# EAGLE schematic buggym (EAGLE 7.3.0)
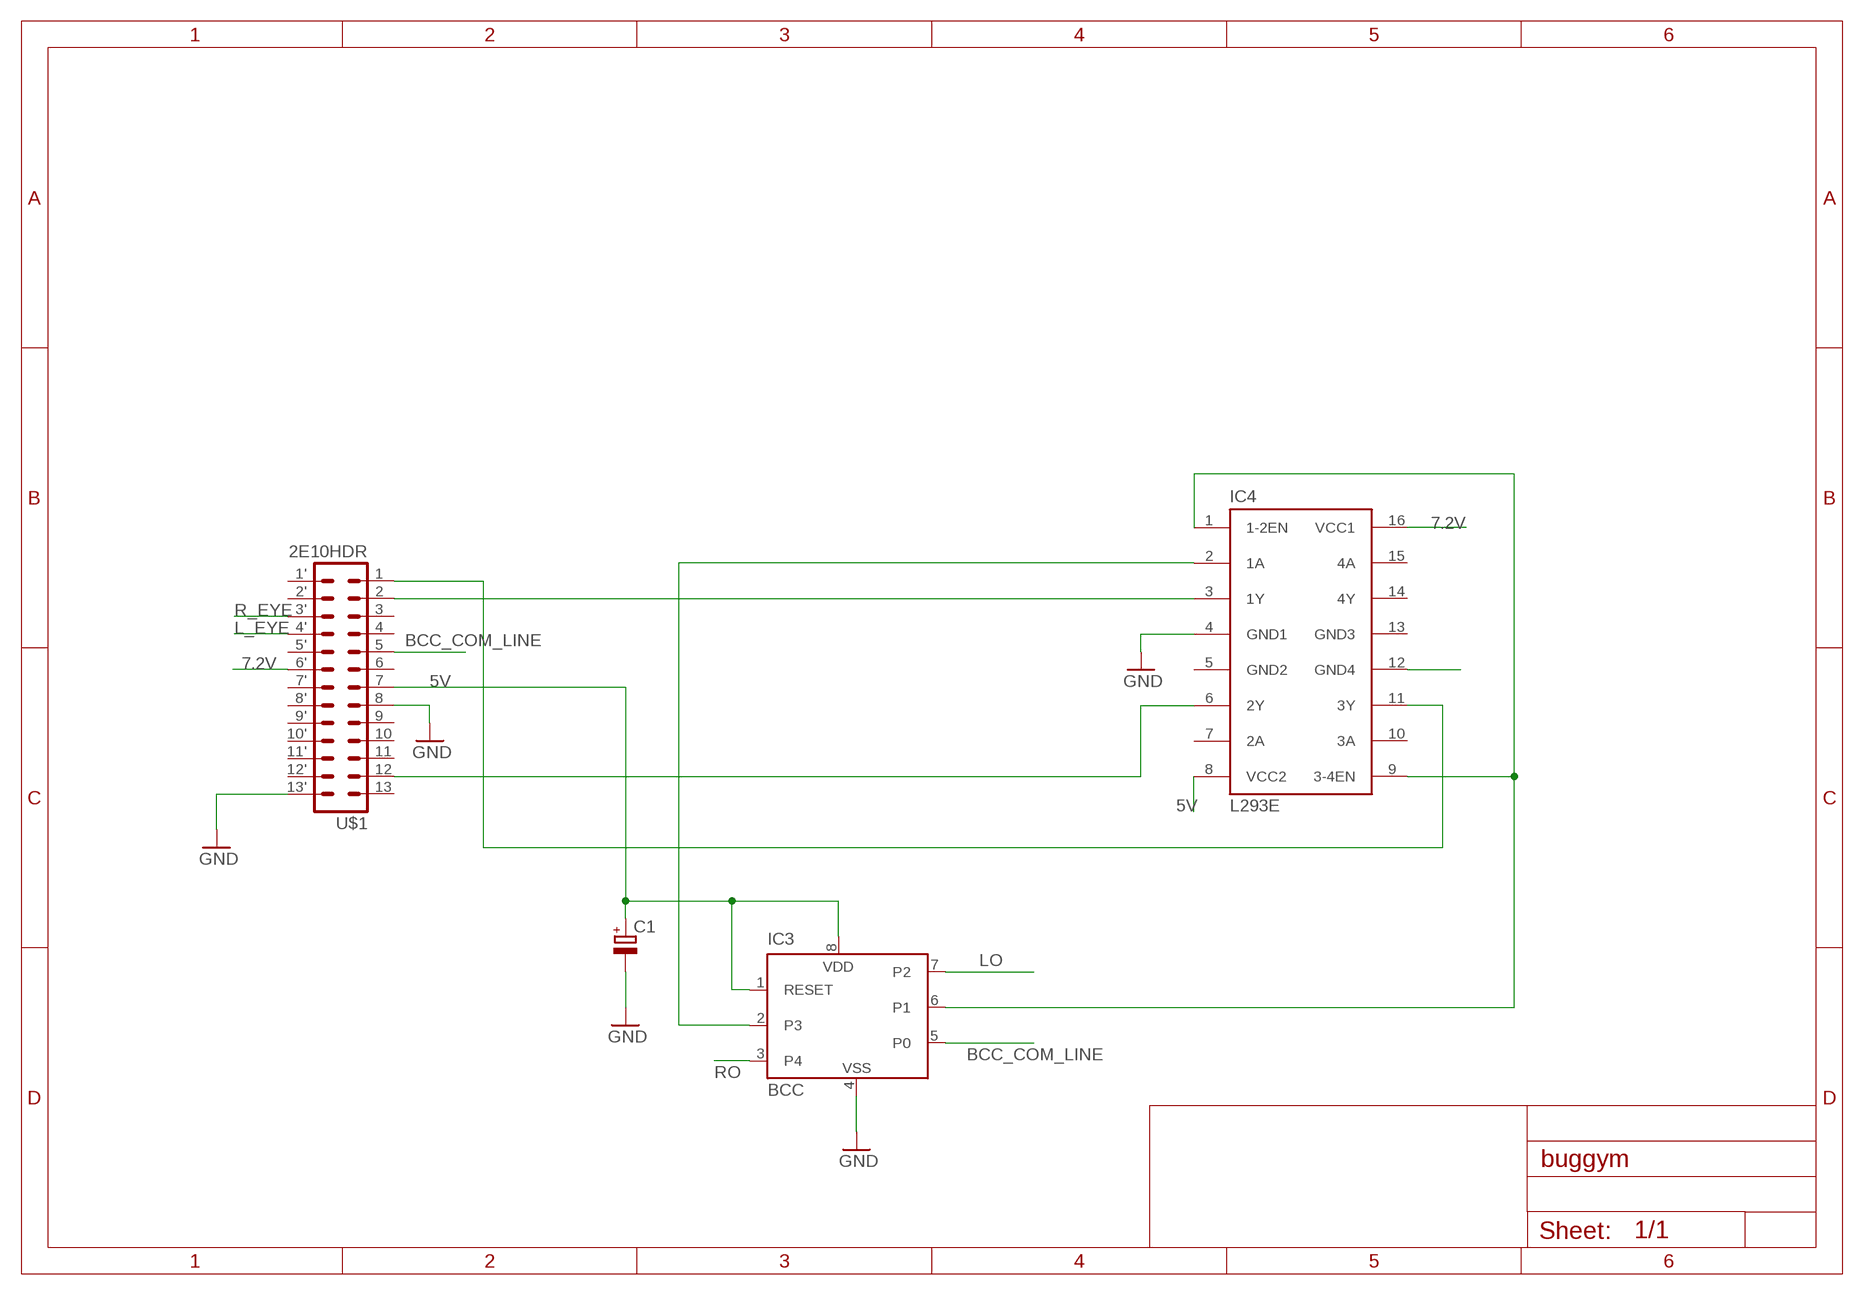
[diagram p0: schematic, sheet 1]

## Parts
C1  CPOL-EUE5-4  [E5-4]
IC3  BCC  [DIL8]
IC4  L293E  [DIL16]
U$1  2E10HDR  [2E10BOARD]

## Nets
5V: C1.+ IC3.1(RESET) IC3.8(5V) IC4.8(VCC2) U$1.7
7.2V: IC4.16(VCC1) U$1.6'
BCC_COM_LINE: IC3.5(P0) U$1.5
GND: C1.- IC3.4(VSS) IC4.4(GND1) U$1.8 U$1.13'
L_EYE: U$1.4'
LO: IC3.7(P2)
N$2: IC3.2(P3) IC4.2(1A)
N$3: IC4.11(3Y) U$1.1
N$5: IC4.6(2Y) U$1.12
N$6: IC4.3(1Y) U$1.2
N$7: IC4.12(GND4)
N$9: IC3.6(P1) IC4.1(1-2EN) IC4.9(3-4EN)
R_EYE: U$1.3'
RO: IC3.3(P4)
Unconnected: IC4.7(2A) IC4.10(3A) IC4.14(4Y) IC4.15(4A) U$1.1' U$1.2' U$1.3 U$1.4 U$1.5' U$1.6 U$1.7' U$1.8' U$1.9 U$1.9' U$1.10 U$1.10' U$1.11 U$1.11' U$1.12' U$1.13

## Power pins joined to a net without a drawn wire
GND2: IC4.5(GND2)
GND3: IC4.13(GND3)

## Library data of the parts
C1 = rcl:CPOL-EU: POLARIZED CAPACITOR, European symbol
IC3 = shane1:BCC
IC4 = texas:L293E: TI DEVICE; MF: Arrow Electronics; MPN: L293E; OC_FARNELL: 1467711; OC_NEWARK: 89K0732
U$1 = 2E10:2E10HDR